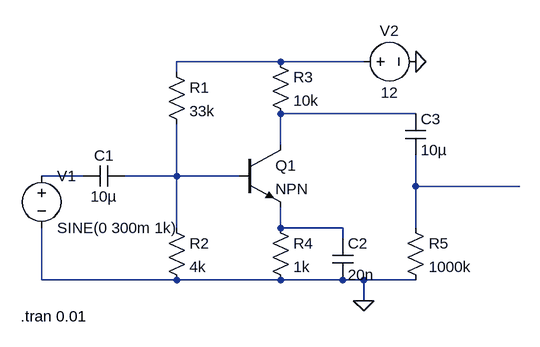
[diagram p0: schematic Draft3.asc]
Draft3.asc, the LTspice schematic file:
Version 4
SHEET 1 880 680
WIRE 352 -48 192 -48
WIRE 480 -48 352 -48
WIRE 192 -32 192 -48
WIRE 560 32 352 32
WIRE 352 80 352 32
WIRE 48 128 -16 128
WIRE 192 128 192 48
WIRE 192 128 112 128
WIRE 288 128 192 128
WIRE 560 144 560 96
WIRE 720 144 560 144
WIRE 192 208 192 128
WIRE 352 208 352 176
WIRE 448 208 352 208
WIRE 560 208 560 144
WIRE 448 224 448 208
WIRE -16 288 -16 208
WIRE 192 288 -16 288
WIRE 352 288 192 288
WIRE 448 288 352 288
WIRE 480 288 448 288
WIRE 560 288 480 288
WIRE 480 320 480 288
FLAG 480 320 0
FLAG 560 -48 0
SYMBOL npn 288 80 R0
SYMATTR InstName Q1
SYMBOL voltage -16 112 R0
WINDOW 123 0 0 Left 0
WINDOW 39 0 0 Left 0
SYMATTR InstName V1
SYMATTR Value SINE(0 300m 1k)
SYMBOL cap 48 144 R270
WINDOW 0 32 32 VTop 2
WINDOW 3 0 32 VBottom 2
SYMATTR InstName C1
SYMATTR Value 10µ
SYMBOL res 176 -48 R0
SYMATTR InstName R1
SYMATTR Value 33k
SYMBOL res 176 192 R0
SYMATTR InstName R2
SYMATTR Value 4k
SYMBOL res 336 -64 R0
SYMATTR InstName R3
SYMATTR Value 10k
SYMBOL res 336 192 R0
SYMATTR InstName R4
SYMATTR Value 1k
SYMBOL cap 432 224 R0
SYMATTR InstName C2
SYMATTR Value 20n
SYMBOL voltage 464 -48 R270
WINDOW 0 32 56 VTop 2
WINDOW 3 -32 56 VBottom 2
WINDOW 123 0 0 Left 0
WINDOW 39 0 0 Left 0
SYMATTR InstName V2
SYMATTR Value 12
SYMBOL cap 544 32 R0
SYMATTR InstName C3
SYMATTR Value 10µ
SYMBOL res 544 192 R0
SYMATTR InstName R5
SYMATTR Value 1000k
TEXT -48 344 Left 2 !.tran 0.01

The netlist it stands for:
* Draft3.asc
Q1 N002 N004 N006 0 NPN
V1 N003 0 SINE(0 300m 1k)
C1 N003 N004 10µ
R1 N001 N004 33k
R2 N004 0 4k
R3 N001 N002 10k
R4 N006 0 1k
C2 N006 0 20n
V2 N001 0 12
C3 N002 N005 10µ
R5 N005 0 1000k
.model NPN NPN
.model PNP PNP
.lib standard.bjt
.tran 0.01
.backanno
.end